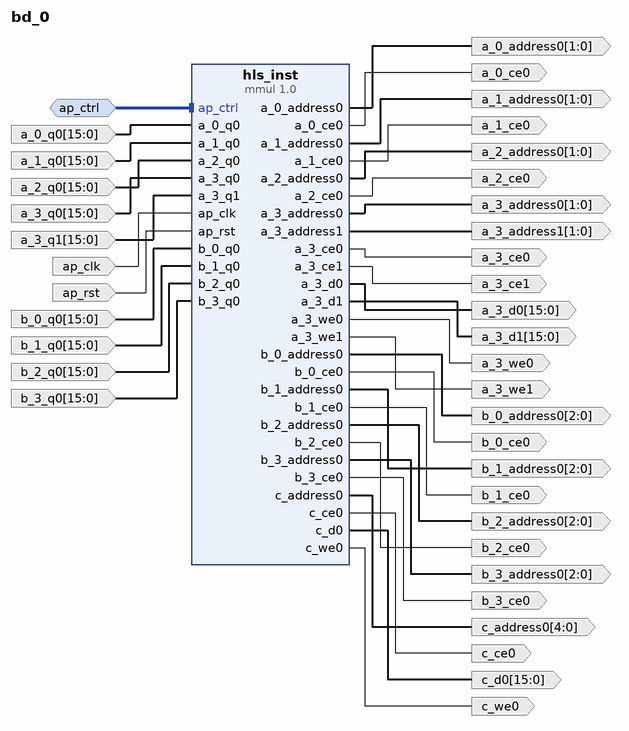
[diagram p0: block diagram of the top level]
# Vivado block design bd_0, xc7k160tfbg676-2, Vivado 2022.1
create_bd_design bd_0

create_bd_intf_port -mode Slave -vlnv xilinx.com:interface:acc_handshake_rtl:1.0 ap_ctrl
create_bd_port -dir O -from 1 -to 0 -type data a_0_address0
create_bd_port -dir O a_0_ce0
create_bd_port -dir I -from 15 -to 0 -type data a_0_q0
create_bd_port -dir O -from 1 -to 0 -type data a_1_address0
create_bd_port -dir O a_1_ce0
create_bd_port -dir I -from 15 -to 0 -type data a_1_q0
create_bd_port -dir O -from 1 -to 0 -type data a_2_address0
create_bd_port -dir O a_2_ce0
create_bd_port -dir I -from 15 -to 0 -type data a_2_q0
create_bd_port -dir O -from 1 -to 0 -type data a_3_address0
create_bd_port -dir O -from 1 -to 0 -type data a_3_address1
create_bd_port -dir O a_3_ce0
create_bd_port -dir O a_3_ce1
create_bd_port -dir O -from 15 -to 0 -type data a_3_d0
create_bd_port -dir O -from 15 -to 0 -type data a_3_d1
create_bd_port -dir I -from 15 -to 0 -type data a_3_q0
create_bd_port -dir I -from 15 -to 0 -type data a_3_q1
create_bd_port -dir O a_3_we0
create_bd_port -dir O a_3_we1
create_bd_port -dir I -type clk ap_clk
set_property -dict {CONFIG.FREQ_HZ 250000000.0} [get_bd_ports ap_clk]
create_bd_port -dir I -type rst ap_rst
set_property -dict {CONFIG.POLARITY ACTIVE_HIGH} [get_bd_ports ap_rst]
create_bd_port -dir O -from 2 -to 0 -type data b_0_address0
create_bd_port -dir O b_0_ce0
create_bd_port -dir I -from 15 -to 0 -type data b_0_q0
create_bd_port -dir O -from 2 -to 0 -type data b_1_address0
create_bd_port -dir O b_1_ce0
create_bd_port -dir I -from 15 -to 0 -type data b_1_q0
create_bd_port -dir O -from 2 -to 0 -type data b_2_address0
create_bd_port -dir O b_2_ce0
create_bd_port -dir I -from 15 -to 0 -type data b_2_q0
create_bd_port -dir O -from 2 -to 0 -type data b_3_address0
create_bd_port -dir O b_3_ce0
create_bd_port -dir I -from 15 -to 0 -type data b_3_q0
create_bd_port -dir O -from 4 -to 0 -type data c_address0
create_bd_port -dir O c_ce0
create_bd_port -dir O -from 15 -to 0 -type data c_d0
create_bd_port -dir O c_we0

create_bd_cell -type ip -vlnv xilinx.com:hls:mmul:1.0 hls_inst

# ---- connections ----

connect_bd_intf_net -intf_net ap_ctrl_0_1 [get_bd_intf_ports ap_ctrl] [get_bd_intf_pins hls_inst/ap_ctrl]
connect_bd_net -net a_0_q0_0_1 [get_bd_ports a_0_q0] [get_bd_pins hls_inst/a_0_q0]
connect_bd_net -net a_1_q0_0_1 [get_bd_ports a_1_q0] [get_bd_pins hls_inst/a_1_q0]
connect_bd_net -net a_2_q0_0_1 [get_bd_ports a_2_q0] [get_bd_pins hls_inst/a_2_q0]
connect_bd_net -net a_3_q0_0_1 [get_bd_ports a_3_q0] [get_bd_pins hls_inst/a_3_q0]
connect_bd_net -net a_3_q1_0_1 [get_bd_ports a_3_q1] [get_bd_pins hls_inst/a_3_q1]
connect_bd_net -net ap_clk_0_1 [get_bd_ports ap_clk] [get_bd_pins hls_inst/ap_clk]
connect_bd_net -net ap_rst_0_1 [get_bd_ports ap_rst] [get_bd_pins hls_inst/ap_rst]
connect_bd_net -net b_0_q0_0_1 [get_bd_ports b_0_q0] [get_bd_pins hls_inst/b_0_q0]
connect_bd_net -net b_1_q0_0_1 [get_bd_ports b_1_q0] [get_bd_pins hls_inst/b_1_q0]
connect_bd_net -net b_2_q0_0_1 [get_bd_ports b_2_q0] [get_bd_pins hls_inst/b_2_q0]
connect_bd_net -net b_3_q0_0_1 [get_bd_ports b_3_q0] [get_bd_pins hls_inst/b_3_q0]
connect_bd_net [get_bd_pins hls_inst/a_0_address0] [get_bd_ports a_0_address0]
connect_bd_net [get_bd_pins hls_inst/a_0_ce0] [get_bd_ports a_0_ce0]
connect_bd_net [get_bd_pins hls_inst/a_1_address0] [get_bd_ports a_1_address0]
connect_bd_net [get_bd_pins hls_inst/a_1_ce0] [get_bd_ports a_1_ce0]
connect_bd_net [get_bd_pins hls_inst/a_2_address0] [get_bd_ports a_2_address0]
connect_bd_net [get_bd_pins hls_inst/a_2_ce0] [get_bd_ports a_2_ce0]
connect_bd_net [get_bd_pins hls_inst/a_3_address0] [get_bd_ports a_3_address0]
connect_bd_net [get_bd_pins hls_inst/a_3_address1] [get_bd_ports a_3_address1]
connect_bd_net [get_bd_pins hls_inst/a_3_ce0] [get_bd_ports a_3_ce0]
connect_bd_net [get_bd_pins hls_inst/a_3_ce1] [get_bd_ports a_3_ce1]
connect_bd_net [get_bd_pins hls_inst/a_3_d0] [get_bd_ports a_3_d0]
connect_bd_net [get_bd_pins hls_inst/a_3_d1] [get_bd_ports a_3_d1]
connect_bd_net [get_bd_pins hls_inst/a_3_we0] [get_bd_ports a_3_we0]
connect_bd_net [get_bd_pins hls_inst/a_3_we1] [get_bd_ports a_3_we1]
connect_bd_net [get_bd_pins hls_inst/b_0_address0] [get_bd_ports b_0_address0]
connect_bd_net [get_bd_pins hls_inst/b_0_ce0] [get_bd_ports b_0_ce0]
connect_bd_net [get_bd_pins hls_inst/b_1_address0] [get_bd_ports b_1_address0]
connect_bd_net [get_bd_pins hls_inst/b_1_ce0] [get_bd_ports b_1_ce0]
connect_bd_net [get_bd_pins hls_inst/b_2_address0] [get_bd_ports b_2_address0]
connect_bd_net [get_bd_pins hls_inst/b_2_ce0] [get_bd_ports b_2_ce0]
connect_bd_net [get_bd_pins hls_inst/b_3_address0] [get_bd_ports b_3_address0]
connect_bd_net [get_bd_pins hls_inst/b_3_ce0] [get_bd_ports b_3_ce0]
connect_bd_net [get_bd_pins hls_inst/c_address0] [get_bd_ports c_address0]
connect_bd_net [get_bd_pins hls_inst/c_ce0] [get_bd_ports c_ce0]
connect_bd_net [get_bd_pins hls_inst/c_d0] [get_bd_ports c_d0]
connect_bd_net [get_bd_pins hls_inst/c_we0] [get_bd_ports c_we0]

validate_bd_design
save_bd_design
